# EAGLE schematic Adafruit PowerBoost 1000 Basic (EAGLE 9.6.2)
COMPANY: ADAFRUIT INDUSTRIES; DRAWN: KTOWN; REV: A
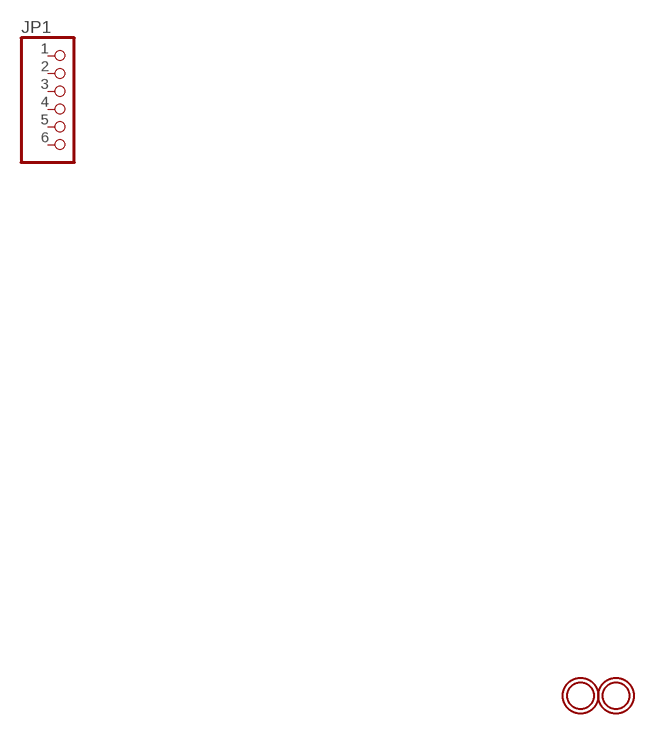
[diagram p0: schematic, sheet 1]

## Parts
JP1  PINHD-1X6CB  [1X06-CLEANBIG]
U$10  MOUNTINGHOLE2.5  [MOUNTINGHOLE_2.5_PLATED]
U$11  MOUNTINGHOLE2.5  [MOUNTINGHOLE_2.5_PLATED]
Unconnected: JP1.1 JP1.2 JP1.3 JP1.4 JP1.5 JP1.6

## Library data of the parts
JP1 = adafruit:PINHD-1X6: PIN HEADER
U$10 U$11 = microbuilder:MOUNTINGHOLE: Mounting Hole For #2 screws (0.086"/2.18mm width, 0.094"/2.4mm hole) use 2.5mm; BOM: EXCLUDE